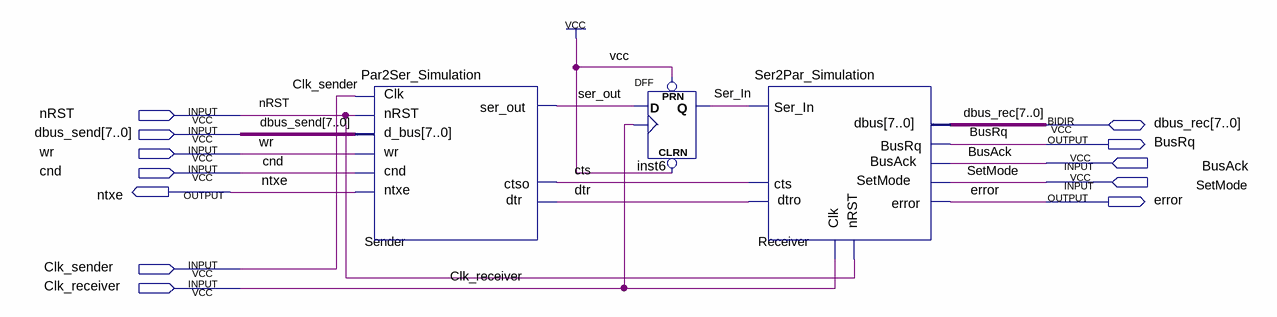
[diagram p0: schematic sheet]
// Quartus schematic DSD_UART_Simulation.bdf as structural Verilog: 3 symbols, 12 pins
module DSD_UART_Simulation (
  input  nRST,
  input  [7:0] dbus_send,
  input  wr,
  input  BusAck,
  input  cnd,
  input  SetMode,
  input  Clk_sender,
  input  Clk_receiver,
  inout  [7:0] dbus_rec,
  output BusRq,
  output ntxe,
  output error
);

  wire cts, dtr, Ser_In, ser_out;

  Par2Ser_Simulation Sender (
    .cnd(cnd), .wr(wr), .Clk(Clk_sender), .d_bus(dbus_send), .nRST(nRST), .dtr(dtr), .ntxe(ntxe),
    .ser_out(ser_out), .ctso(cts));
  DFF inst6 (.CLRN(1'b1), .CLK(Clk_receiver), .D(ser_out), .PRN(1'b1), .Q(Ser_In));
  Ser2Par_Simulation Receiver (
    .cts(cts), .Clk(Clk_receiver), .nRST(nRST), .Ser_In(Ser_In), .BusAck(BusAck), .SetMode(SetMode),
    .dtro(dtr), .BusRq(BusRq), .error(error), .dbus(dbus_rec));
endmodule
